# Altium schematic sheet sub-1Ghz_radio.SchDoc: Sub-1GHz Radio Module
size A3; Hw_rev: 0; License: GPLv3; Address3: Firenze; Address4: ITALY; DocumentNumber: 5; Revision: 0; SheetNumber: 5; SheetTotal: 8
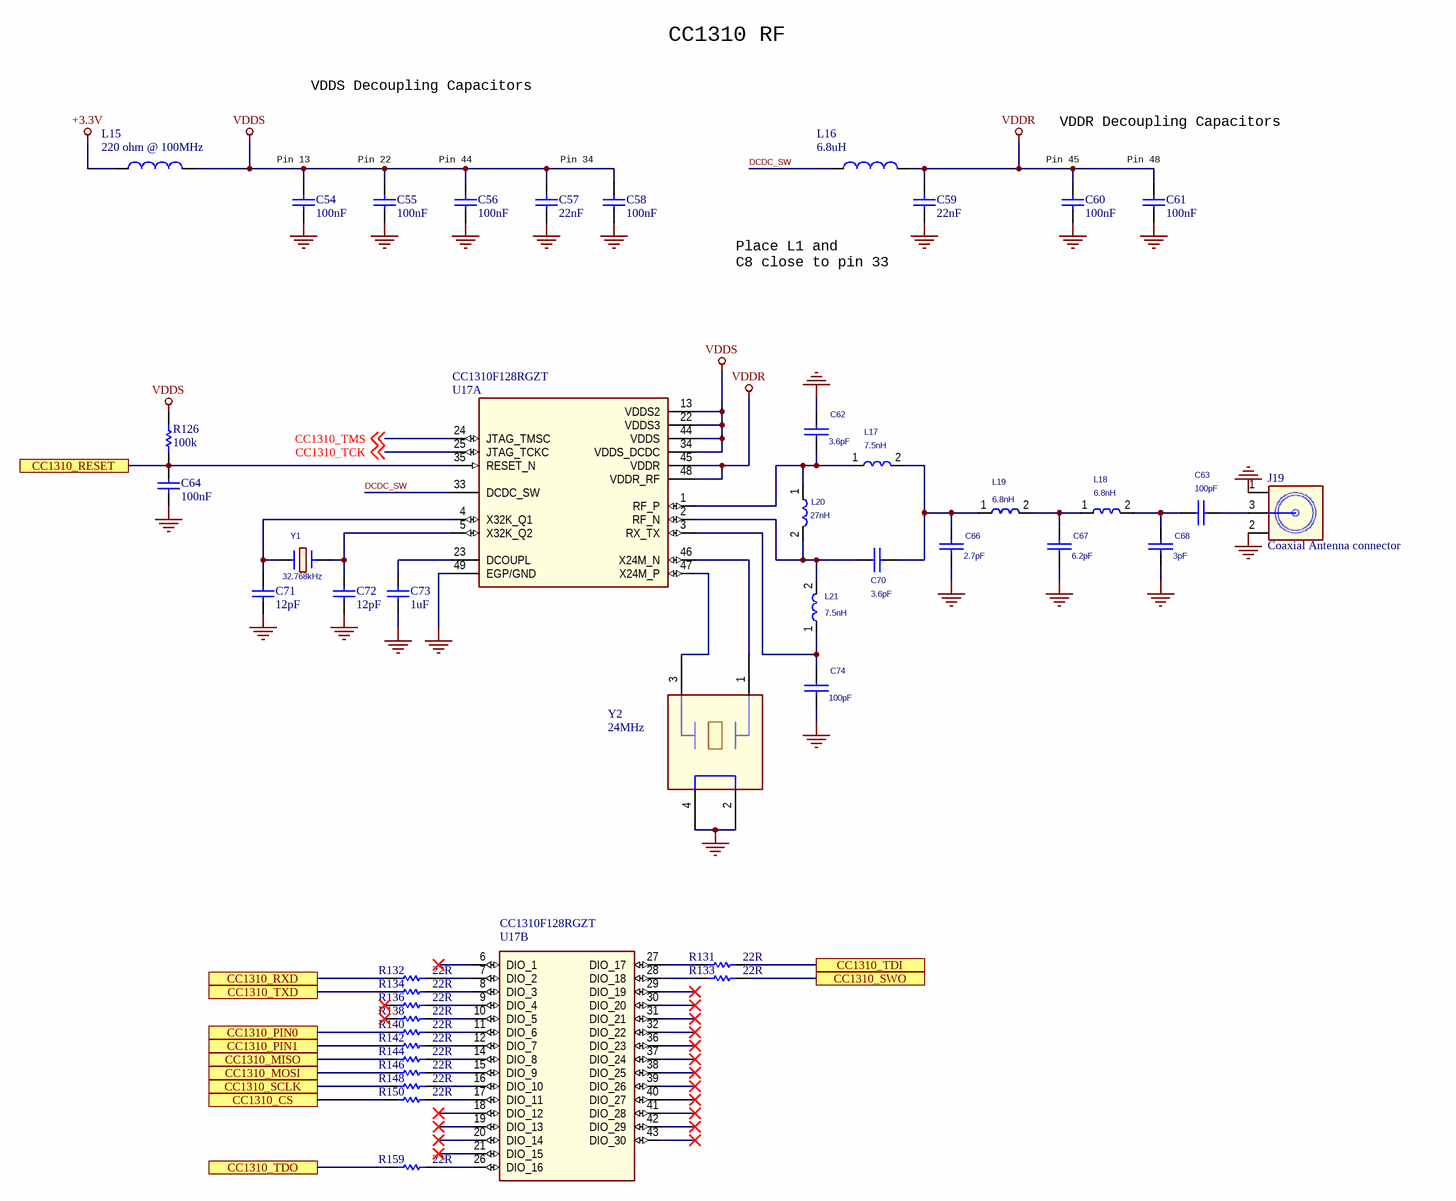
[diagram p0: sub-1Ghz_radio.SchDoc]

## Parts
C54  100nF  [0603_[1608]]
C55  100nF  [0603_[1608]]
C56  100nF  [0603_[1608]]
C57  22nF  [0603_[1608]]
C58  100nF  [0603_[1608]]
C59  22nF  [0603_[1608]]
C60  100nF  [0603_[1608]]
C61  100nF  [0603_[1608]]
C62  3.6pF  [0402_[1005]]
C63  100pF  [0402_[1005]]
C64  100nF  [0603_[1608]]
C66  2.7pF  [0402_[1005]]
C67  6.2pF  [0402_[1005]]
C68  3pF  [0402_[1005]]
C70  3.6pF  [0402_[1005]]
C71  12pF  [0603_[1608]]
C72  12pF  [0603_[1608]]
C73  1uF  [0805_[2012]]
C74  100pF  [0402_[1005]]
J19  Coaxial Antenna connector  [U.FL_COAXIAL_2.6x2.6MM_STRAIGHT_SMD]
L15  220 ohm @ 100MHz  [0805_[2012]]
L16  6.8uH  [0805_[2012]]
L17  7.5nH  [0402_[1005]]
L18  6.8nH  [0402_[1005]]
L19  6.8nH  [0402_[1005]]
L20  27nH  [0402_[1005]]
L21  7.5nH  [0402_[1005]]
R126  100k  [0603_[1608]]
R131  22R  [0603_[1608]]
R132  22R  [0603_[1608]]
R133  22R  [0603_[1608]]
R134  22R  [0603_[1608]]
R136  22R  [0603_[1608]]
R138  22R  [0603_[1608]]
R140  22R  [0603_[1608]]
R142  22R  [0603_[1608]]
R144  22R  [0603_[1608]]
R146  22R  [0603_[1608]]
R148  22R  [0603_[1608]]
R150  22R  [0603_[1608]]
R159  22R  [0603_[1608]]
U17  CC1310F128RGZT  [PQFN50P700X700X100-48N]  (parts A,B of 2)
Y1  32.768kHz  [CRYSTAL_3.2X1.5MM_2P_SMD]
Y2  24MHz  [CRYSTAL_3.2X2.5MM_4P_SMD]

## Ports
CC1310_CS, CC1310_MISO, CC1310_MOSI, CC1310_PIN0, CC1310_PIN1, CC1310_RESET, CC1310_RXD, CC1310_SCLK, CC1310_SWO, CC1310_TDI, CC1310_TDO, CC1310_TXD

## Nets
+3.3V: L15.2
GND: C54.1 C55.1 C56.1 C57.1 C58.1 C59.1 C60.1 C61.1 C62.1 C64.1 C66.2 C67.2 C68.2 C71.1 C72.1 C73.1 C74.2 J19.1(GND) J19.2(GND) U17.49(EGP/GND) Y2.2 Y2.4
VDDR: C59.2 C60.2 C61.2 L16.1 U17.45(VDDR) U17.48(VDDR_RF)
VDDS: C54.2 C55.2 C56.2 C57.2 C58.2 L15.1 R126.1 U17.13(VDDS2) U17.22(VDDS3) U17.34(VDDS_DCDC) U17.44(VDDS)
CC1310_CS: R150.2 ; port CC1310_CS
CC1310_MISO: R144.2 ; port CC1310_MISO
CC1310_MOSI: R146.2 ; port CC1310_MOSI
CC1310_PIN0: R140.2 ; port CC1310_PIN0
CC1310_PIN1: R142.2 ; port CC1310_PIN1
CC1310_RESET: C64.2 R126.2 U17.35(RESET_N) ; port CC1310_RESET
CC1310_RXD: R132.2 ; port CC1310_RXD
CC1310_SCLK: R148.2 ; port CC1310_SCLK
CC1310_SWO: R133.1 ; port CC1310_SWO
CC1310_TCK: U17.25(JTAG_TCKC) ; off-sheet CC1310_TCK
CC1310_TDI: R131.1 ; port CC1310_TDI
CC1310_TDO: R159.2 ; port CC1310_TDO
CC1310_TMS: U17.24(JTAG_TMSC) ; off-sheet CC1310_TMS
CC1310_TXD: R134.2 ; port CC1310_TXD
DCDC_SW: L16.2 U17.33(DCDC_SW)
NetC62_2: C62.2 L17.1 L20.1 U17.1(RF_P)
NetC63_1: C63.1 C68.1 L18.2
NetC63_2: C63.2 J19.3(SIG)
NetC66_1: C66.1 C70.2 L17.2 L19.1
NetC67_1: C67.1 L18.1 L19.2
NetC70_1: C70.1 L20.2 L21.2 U17.2(RF_N)
NetC71_2: C71.2 U17.4(X32K_Q1) Y1.1
NetC72_2: C72.2 U17.5(X32K_Q2) Y1.2
NetC73_2: C73.2 U17.23(DCOUPL)
NetC74_1: C74.1 L21.1 U17.3(RX_TX)
NetR131_2: R131.2 U17.27(DIO_17)
NetR132_1: R132.1 U17.7(DIO_2)
NetR133_2: R133.2 U17.28(DIO_18)
NetR134_1: R134.1 U17.8(DIO_3)
NetR136_1: R136.1 U17.9(DIO_4)
NetR138_1: R138.1 U17.10(DIO_5)
NetR140_1: R140.1 U17.11(DIO_6)
NetR142_1: R142.1 U17.12(DIO_7)
NetR144_1: R144.1 U17.14(DIO_8)
NetR146_1: R146.1 U17.15(DIO_9)
NetR148_1: R148.1 U17.16(DIO_10)
NetR150_1: R150.1 U17.17(DIO_11)
NetR159_1: R159.1 U17.26(DIO_16)
NetU17_46: U17.46(X24M_N) Y2.1
NetU17_47: U17.47(X24M_P) Y2.3

Not connected (* = marked no-connect by the designer): R136 2*; R138 2*; U17 6(DIO_1)* 18(DIO_12)* 19(DIO_13)* 20(DIO_14)* 21(DIO_15)* 29(DIO_19)* 30(DIO_20)* 31(DIO_21)* 32(DIO_22)* 36(DIO_23)* 37(DIO_24)* 38(DIO_25)* 39(DIO_26)* 40(DIO_27)* 41(DIO_28)* 42(DIO_29)* 43(DIO_30)*

## Notes on the sheet
- VDDS Decoupling Capacitors
- CC1310 RF
- VDDR Decoupling Capacitors
- (near C54) Pin 13
- (near C55) Pin 22
- (near C56) Pin 44
- Pin 34
- (near C60) Pin 45
- (near C61) Pin 48
- (near C59) Place L1 and
  C8 close to pin 33

## Library data of the parts
C54-C61 C64 C71-C73 = Cap: Ceramic X7R 50V; Value: 100pF; Published: 8-Jun-2000; LatestRevisionDate: 17-Jul-2002; LatestRevisionNote: Re-released for DXP Platform.; PackageReference: RAD-0.3; Publisher: Altium Limited; PackageDescription: Radial Cap, Thru-Hole; 2 Leads; 0.3 in Pin Spacing
C62 = CAPACITOR: CAPACITOR, CERAMIC C0G/NP0, 3.6pF, 50V, -0.25pF/+0.25pF, -55DEGC/+125DEGC, 0402, SMD; Vendor Part Status: ACTIVE; Vendor Part Number: GRM1555C1H3R6CA01D; Part Number: 02-07631; VOLTAGE: CMAX; CURRENT: CIMAX; KNEE: CBMAX; PSpiceTemplate: C^@REFDES %1 %2 ?TOLERANCE|C^@REFDES| @VALUE ?IC/IC=@IC/ TC=@TC1,@TC2 ?TOLERANCE|\n.model C^@REFDES CAP C=1 DEV=@TOLERANCE%|; DIST: FLAT; SLOPE: CSMAX; MAX_TEMP: CTMAX; TC1: 0; Vendor: MURATA; BU Name: TEXAS INSTRUMENTS NORWAY; Packing Type: TAPE_&_REEL; Packing Size: 10000; Definied Quality: INDUSTRIAL; Budget Currency: EUR; Budget Price: 0.006; Lead Time: 12; NOTE Status: PREFERRED; PCB Package: 0402; Old Footprint: CAPC1005X60N; TC2: 0; Value: 3.6pF; Country of Origin: MISSING INFO; AutoDoc File: https://notefied-dynamic-precision.com/DB/Apps/Desktop/Item/Object.aspx?id=113359; Datasheet URL 2: N/A; Datasheet URL 1: http://psearch.murata.com/capacitor/product/GRM1555C1H3R6CA01%23.pdf; MSL: N/A; MTBF Standard: N/A; MTBF: N/A; Esd Level: N/A; WEIGHT: 0.0016g; Last Time Buy: N/A; LifeCycle Status: ACTIVE; RoHS Status: ROHS_COMPLIANT; MPN Status: ACTIVE; MPN: GRM1555C1H3R6CA01D; Manufacturer: MURATA; Dielectric Type: C0G/NP0; Capacitance: 3.6pF; Rtd Voltage: 50V; Min Tol: -0.25pF; Max Tol: +0.25pF; Min Oper Temp: -55DEGC; Max Oper Temp: +125DEGC; Part Type: CAPACITOR\CERAMIC\0402\STANDARD; Mounting Type: SMD; Revision: R000
C63 C74 = CAPACITOR: Ceramic COG 50V; Vendor Part Status: ACTIVE; Vendor Part Number: GRM1555C1H101JA01D; Part Number: 02-07619; VOLTAGE: CMAX; CURRENT: CIMAX; KNEE: CBMAX; PSpiceTemplate: C^@REFDES %1 %2 ?TOLERANCE|C^@REFDES| @VALUE ?IC/IC=@IC/ TC=@TC1,@TC2 ?TOLERANCE|\n.model C^@REFDES CAP C=1 DEV=@TOLERANCE%|; DIST: FLAT; SLOPE: CSMAX; MAX_TEMP: CTMAX; TC1: 0; Vendor: MURATA; BU Name: TEXAS INSTRUMENTS NORWAY; Packing Type: TAPE_&_REEL; Packing Size: 10000; Definied Quality: INDUSTRIAL; Budget Currency: EUR; Budget Price: 0.004; Lead Time: 12; NOTE Status: PREFERRED; Dielectric Type: C0G/NP0; Min Tol: -5%; Max Tol: +5%; Min Oper Temp: -55DEGC; Max Oper Temp: +125DEGC; PCB Package: 0402; Old Footprint: CAPC1005X60N; TC2: 0; Value: 100pF; Country of Origin: CHINA,PHILIPPINES; AutoDoc File: https://notefied-dynamic-precision.com/DB/Apps/Desktop/Item/Object.aspx?id=113347; Datasheet URL 2: http://search.murata.co.jp/Ceramy/image/img/w_hinm/L0005E.pdf; Datasheet URL 1: http://psearch.murata.com/capacitor/product/GRM1555C1H101JA01%23.pdf; MSL: 1; MTBF Standard: N/A; MTBF: N/A; Esd Level: N/A; WEIGHT: 0.0016g; Last Time Buy: N/A; LifeCycle Status: ACTIVE; RoHS Status: ROHS_COMPLIANT; MPN Status: ACTIVE; MPN: GRM1555C1H101JA01D; Manufacturer: MURATA; Capacitance: 100pF; Rtd Voltage: 50V; Part Type: CAPACITOR\CERAMIC\0402\STANDARD; Mounting Type: SMD; Revision: R000
C66 = CAPACITOR: CAPACITOR, CERAMIC C0G/NP0, 2.7pF, 50V, -0.25pF/+0.25pF, -55DEGC/+125DEGC, 0402, SMD; MPN Status: ACTIVE; MPN: GRM1555C1H2R7CA01D; Manufacturer: MURATA; Part Number: 02-07628; VOLTAGE: CMAX; CURRENT: CIMAX; KNEE: CBMAX; PSpiceTemplate: C^@REFDES %1 %2 ?TOLERANCE|C^@REFDES| @VALUE ?IC/IC=@IC/ TC=@TC1,@TC2 ?TOLERANCE|\n.model C^@REFDES CAP C=1 DEV=@TOLERANCE%|; DIST: FLAT; SLOPE: CSMAX; MAX_TEMP: CTMAX; TC1: 0; Packing Type: TAPE_&_REEL; Packing Size: 10000; Definied Quality: INDUSTRIAL; Budget Currency: EUR; Budget Price: 0.007; Lead Time: 12; NOTE Status: PREFERRED; PCB Package: 0402; Old Footprint: CAPC1005X60N; BU Name: TEXAS INSTRUMENTS NORWAY; TC2: 0; Value: 2.7pF; AutoDoc File: https://notefied-dynamic-precision.com/DB/Apps/Desktop/Item/Object.aspx?id=113356; Datasheet URL 2: http://search.murata.co.jp/Ceramy/image/img/w_hinm/L0005E.pdf; Datasheet URL 1: http://psearch.murata.com/capacitor/product/GRM1555C1H2R7CA01%23.pdf; MSL: 1; MTBF Standard: N/A; MTBF: N/A; Esd Level: N/A; WEIGHT: 0.0016g; Last Time Buy: N/A; LifeCycle Status: ACTIVE; RoHS Status: ROHS_COMPLIANT; Dielectric Type: C0G/NP0; Capacitance: 2.7pF; Rtd Voltage: 50V; Min Tol: -0.25pF; Max Tol: +0.25pF; Min Oper Temp: -55DEGC; Max Oper Temp: +125DEGC; Part Type: CAPACITOR\CERAMIC\0402\STANDARD; Mounting Type: SMD; Revision: R000; Vendor: MURATA; Vendor Part Number: GRM1555C1H2R7CA01D; Vendor Part Status: ACTIVE; Country of Origin: PHILIPPINES
C67 = CAPACITOR: CAPACITOR, CERAMIC C0G/NP0, 6.2pF, 50V, -0.25pF/+0.25pF, -55DEGC/+125DEGC, 0402, SMD; MPN Status: ACTIVE; MPN: GRM1555C1H6R2CA01D; Manufacturer: MURATA; Part Number: 02-07626; VOLTAGE: CMAX; CURRENT: CIMAX; KNEE: CBMAX; PSpiceTemplate: C^@REFDES %1 %2 ?TOLERANCE|C^@REFDES| @VALUE ?IC/IC=@IC/ TC=@TC1,@TC2 ?TOLERANCE|\n.model C^@REFDES CAP C=1 DEV=@TOLERANCE%|; DIST: FLAT; SLOPE: CSMAX; MAX_TEMP: CTMAX; TC1: 0; Packing Type: TAPE_&_REEL; Packing Size: 10000; Definied Quality: INDUSTRIAL; Budget Currency: EUR; Budget Price: 0.007; Lead Time: 14; NOTE Status: PREFERRED; PCB Package: 0402; Old Footprint: CAPC1005X60N; BU Name: TEXAS INSTRUMENTS NORWAY; TC2: 0; Value: 6.2pF; AutoDoc File: https://notefied-dynamic-precision.com/DB/Apps/Desktop/Item/Object.aspx?id=113354; Datasheet URL 2: http://search.murata.co.jp/Ceramy/image/img/w_hinm/L0005E.pdf; Datasheet URL 1: http://psearch.murata.com/capacitor/product/GRM1555C1H6R2CA01%23.pdf; MSL: 1; MTBF Standard: N/A; MTBF: N/A; Esd Level: N/A; WEIGHT: 0.0016g; Last Time Buy: N/A; LifeCycle Status: ACTIVE; RoHS Status: ROHS_COMPLIANT; Dielectric Type: C0G/NP0; Capacitance: 6.2pF; Rtd Voltage: 50V; Min Tol: -0.25pF; Max Tol: +0.25pF; Min Oper Temp: -55DEGC; Max Oper Temp: +125DEGC; Part Type: CAPACITOR\CERAMIC\0402\STANDARD; Mounting Type: SMD; Revision: R000; Vendor: MURATA; Vendor Part Number: GRM1555C1H6R2CA01D; Vendor Part Status: ACTIVE; Country of Origin: PHILIPPINES
C68 = CAPACITOR: CAPACITOR, CERAMIC C0G/NP0, 3pF, 50V, -0.25pF/+0.25pF, -55DEGC/+125DEGC, 0402, SMD; MPN Status: ACTIVE; MPN: GRM1555C1H3R0CA01D; Manufacturer: MURATA; Part Number: 02-07625; VOLTAGE: CMAX; CURRENT: CIMAX; KNEE: CBMAX; PSpiceTemplate: C^@REFDES %1 %2 ?TOLERANCE|C^@REFDES| @VALUE ?IC/IC=@IC/ TC=@TC1,@TC2 ?TOLERANCE|\n.model C^@REFDES CAP C=1 DEV=@TOLERANCE%|; DIST: FLAT; SLOPE: CSMAX; MAX_TEMP: CTMAX; TC1: 0; Packing Type: TAPE_&_REEL; Packing Size: 10000; Definied Quality: INDUSTRIAL; Budget Currency: EUR; Budget Price: 0.006; Lead Time: 16; NOTE Status: PREFERRED; PCB Package: 0402; Old Footprint: CAPC1005X60N; BU Name: TEXAS INSTRUMENTS NORWAY; TC2: 0; Value: 3pF; AutoDoc File: https://notefied-dynamic-precision.com/DB/Apps/Desktop/Item/Object.aspx?id=113353; Datasheet URL 2: http://search.murata.co.jp/Ceramy/image/img/w_hinm/L0005E.pdf; Datasheet URL 1: http://psearch.murata.com/capacitor/product/GRM1555C1H3R0CA01%23.pdf; MSL: 1; MTBF Standard: N/A; MTBF: N/A; Esd Level: N/A; WEIGHT: 0.0016g; Last Time Buy: N/A; LifeCycle Status: ACTIVE; RoHS Status: ROHS_COMPLIANT; Dielectric Type: C0G/NP0; Capacitance: 3pF; Rtd Voltage: 50V; Min Tol: -0.25pF; Max Tol: +0.25pF; Min Oper Temp: -55DEGC; Max Oper Temp: +125DEGC; Part Type: CAPACITOR\CERAMIC\0402\STANDARD; Mounting Type: SMD; Revision: R000; Vendor: MURATA; Vendor Part Number: GRM1555C1H3R0CA01D; Vendor Part Status: ACTIVE; Country of Origin: PHILIPPINES
C70 = CAPACITOR: CAPACITOR, CERAMIC C0G/NP0, 3.6pF, 50V, -0.25pF/+0.25pF, -55DEGC/+125DEGC, 0402, SMD; Vendor Part Status: ACTIVE; Vendor Part Number: GRM1555C1H3R6CA01D; Part Number: 02-07631; VOLTAGE: CMAX; CURRENT: CIMAX; KNEE: CBMAX; PSpiceTemplate: C^@REFDES %1 %2 ?TOLERANCE|C^@REFDES| @VALUE ?IC/IC=@IC/ TC=@TC1,@TC2 ?TOLERANCE|\n.model C^@REFDES CAP C=1 DEV=@TOLERANCE%|; DIST: FLAT; SLOPE: CSMAX; MAX_TEMP: CTMAX; TC1: 0; Vendor: MURATA; BU Name: TEXAS INSTRUMENTS NORWAY; Old Footprint: CAPC1005X60N; PCB Package: 0402; NOTE Status: PREFERRED; Lead Time: 12; Budget Price: 0.006; Budget Currency: EUR; Definied Quality: INDUSTRIAL; Packing Size: 10000; Packing Type: TAPE_&_REEL; TC2: 0; Value: 3.6pF; Country of Origin: MISSING INFO; Revision: R000; Mounting Type: SMD; Part Type: CAPACITOR\CERAMIC\0402\STANDARD; Max Oper Temp: +125DEGC; Min Oper Temp: -55DEGC; Max Tol: +0.25pF; Min Tol: -0.25pF; Rtd Voltage: 50V; Capacitance: 3.6pF; Dielectric Type: C0G/NP0; Manufacturer: MURATA; MPN: GRM1555C1H3R6CA01D; MPN Status: ACTIVE; RoHS Status: ROHS_COMPLIANT; LifeCycle Status: ACTIVE; Last Time Buy: N/A; WEIGHT: 0.0016g; Esd Level: N/A; MTBF: N/A; MTBF Standard: N/A; MSL: N/A; Datasheet URL 1: http://psearch.murata.com/capacitor/product/GRM1555C1H3R6CA01%23.pdf; Datasheet URL 2: N/A; AutoDoc File: https://notefied-dynamic-precision.com/DB/Apps/Desktop/Item/Object.aspx?id=113359
J19 = ANTENNA_3P_COAXIAL_CONNECTOR: U.FL serias
L15 = Inductor: WE 742792022
L16 = Inductor: Inductor WE 742792022
L17 L21 = INDUCTOR: INDUCTOR, RF, CHIP, NON-MAGNETIC CORE, 7.5nH, -5%/+5%, 0.3A, -55DEGC/+125DEGC, 0402, SMD; Part Number: 03-07533; Vendor Part Number: LQG15HS7N5J02D; Vendor Part Status: ACTIVE; DIST: FLAT; DIELECTRIC: DSMAX; PSpiceTemplate: L^@REFDES %1 %2 ?TOLERANCE|L^@REFDES| @VALUE ?IC/IC=@IC/ ?TOLERANCE|\n.model l^@REFDES IND L=1 DEV=@TOLERANCE%|; Current: LMAX; BU Name: TEXAS INSTRUMENTS NORWAY; PCB Package: 0402; Max Tol: +5%; Min Tol: -5%; Resistance: 0.24; Frequency: 4.2GHz; Vendor: MURATA; Lead Time: 10; Budget Price: 0.03; Budget Currency: EUR; Packing Size: 10000; Packing Type: TAPE_&_REEL; Value: 7.5nH; Revision: R000; Mounting Type: SMD; Part Type: INDUCTOR\RF\CHIP\0402; Max Oper Temp: +125DEGC; Min Oper Temp: -55DEGC; Rtd Current: 0.3A; Inductance: 7.5nH; Core Material: NON-MAGNETIC; RoHS Status: ROHS_COMPLIANT; Last Time Buy: N/A; Weight: 0.001g; Country of Origin: MISSING INFO; Datasheet URL 1: http://psearch.murata.com/inductor/product/LQG15HS7N5J02%23.pdf; Datasheet URL 2: N/A; AutoDoc File: https://notefied-dynamic-precision.com/DB/Apps/Desktop/Item/Object.aspx?id=113370
L18 L19 = INDUCTOR: INDUCTOR, RF, CHIP, NON-MAGNETIC CORE, 6.8nH, -5%/+5%, 0.3A, -55DEGC/+125DEGC, 0402, SMD; Vendor Part Status: ACTIVE; Vendor Part Number: LQG15HS6N8J02D; Part Number: 03-07532; DIST: FLAT; DIELECTRIC: DSMAX; PSpiceTemplate: L^@REFDES %1 %2 ?TOLERANCE|L^@REFDES| @VALUE ?IC/IC=@IC/ ?TOLERANCE|\n.model l^@REFDES IND L=1 DEV=@TOLERANCE%|; Current: LMAX; Vendor: MURATA; BU Name: TEXAS INSTRUMENTS NORWAY; Old Footprint: INDC1005X60N; PCB Package: 0402; Max Tol: +5%; Min Tol: -5%; Resistance: 0.24; Frequency: 4.5GHz; NOTE Status: PREFERRED; Lead Time: 9; Budget Price: 0.03; Budget Currency: EUR; Definied Quality: INDUSTRIAL; Packing Size: 10000; Packing Type: TAPE_&_REEL; Value: 6.8nH; Country of Origin: JAPAN,SINGAPORE; Core Material: NON-MAGNETIC; Revision: R000; Mounting Type: SMD; Part Type: INDUCTOR\RF\CHIP\0402; Max Oper Temp: +125DEGC; Min Oper Temp: -55DEGC; Rtd Current: 0.3A; Inductance: 6.8nH; Manufacturer: MURATA; MPN: LQG15HS6N8J02D; MPN Status: ACTIVE; RoHS Status: ROHS_COMPLIANT; LifeCycle Status: ACTIVE; Last Time Buy: N/A; WEIGHT: 0.001g; Esd Level: N/A; MTBF: N/A; MTBF Standard: N/A; MSL: N/A; Datasheet URL 1: http://psearch.murata.com/inductor/product/LQG15HS6N8J02%23.pdf; Datasheet URL 2: N/A; AutoDoc File: https://notefied-dynamic-precision.com/DB/Apps/Desktop/Item/Object.aspx?id=113369
L20 = INDUCTOR: INDUCTOR, RF, CHIP, NON-MAGNETIC CORE, 27nH, -5%/+5%, 0.3A, -55DEGC/+125DEGC, 0402, SMD; Vendor Part Status: ACTIVE; Vendor Part Number: LQG15HS27NJ02D; Part Number: 03-07528; DIST: FLAT; DIELECTRIC: DSMAX; PSpiceTemplate: L^@REFDES %1 %2 ?TOLERANCE|L^@REFDES| @VALUE ?IC/IC=@IC/ ?TOLERANCE|\n.model l^@REFDES IND L=1 DEV=@TOLERANCE%|; Current: LMAX; Vendor: MURATA; BU Name: TEXAS INSTRUMENTS NORWAY; Old Footprint: INDC1005X60N; PCB Package: 0402; Max Tol: +5%; Min Tol: -5%; Resistance: 0.46; Frequency: 1700MHz; NOTE Status: PREFERRED; Lead Time: 9; Budget Price: 0.03; Budget Currency: EUR; Definied Quality: INDUSTRIAL; Packing Size: 10000; Packing Type: TAPE_&_REEL; Value: 27nH; Country of Origin: JAPAN,SINGAPORE; Core Material: NON-MAGNETIC; Revision: R000; Mounting Type: SMD; Part Type: INDUCTOR\RF\CHIP\0402; Max Oper Temp: +125DEGC; Min Oper Temp: -55DEGC; Rtd Current: 0.3A; Inductance: 27nH; Manufacturer: MURATA; MPN: LQG15HS27NJ02D; MPN Status: ACTIVE; RoHS Status: ROHS_COMPLIANT; LifeCycle Status: ACTIVE; Last Time Buy: N/A; WEIGHT: 0.001g; Esd Level: N/A; MTBF: N/A; MTBF Standard: N/A; MSL: N/A; Datasheet URL 1: http://psearch.murata.com/inductor/product/LQG15HS27NJ02%23.pdf; Datasheet URL 2: N/A; AutoDoc File: https://notefied-dynamic-precision.com/DB/Apps/Desktop/Item/Object.aspx?id=113365
R126 R131-R134 R136 R138 R140 R142 R144 R146 R148 R150 R159 = Res1: Resistor; Value: 1K; Published: 8-Jun-2000; Revision: July-2002: Re-released for DXP Platform.; Publisher: Altium Limited
U17 = CC1310F128RGZT_VQFN48: Texas CC1310 RF Cpu; CLASS: IC; SWAP_INFO: (S1+S2); SPLIT_INST: TRUE; Designed_By: Artur Bielinski; Design_Date: 2015-11-27
Y1 = CRYSTAL: CRYSTAL, RESONATOR, 32.768kHz, -20PPM/+20PPM, -40DEGC/+85DEGC, SMD; MPN Status: ACTIVE; MPN: FC-135 32.7680KA-AG0; Manufacturer: EPSON; Part Number: 12-00546; Packing Type: TAPE_&_REEL; Packing Size: 1000; Definied Quality: INDUSTRIAL; Budget Currency: USD; Budget Price: 1.25375; Lead Time: 10; NOTE Status: PREFERRED; Capacitance: 7pF; Min Tol: -20PPM; Max Tol: +20PPM; Old Footprint: XTAL_FC-135N; ALT_SYMBOLS: XTAL_FC-135L,XTAL_FC-135M; FPLIST: XTAL_FC-135N,XTAL_FC-135L,XTAL_FC-135M; AutoDoc File: http://notefied-dynamic-precision.com/DB/Apps/Desktop/Item/Object.aspx?id=91966; Datasheet URL 2: http://www.eea.epson.com/portal/pls/portal/docs/1/1525451.PDF; Datasheet URL 1: http://www.eea.epson.com/portal/pls/portal/docs/1/1525528.PDF; MSL: N/A; MTBF Standard: N/A; MTBF: N/A; Esd Level: N/A; WEIGHT: N/A; Last Time Buy: N/A; RoHS Status: ROHS_COMPLIANT; Frequency: 32.768kHz; Min Oper Temp: -40DEGC; Max Oper Temp: +85DEGC; Part Type: CRYSTAL\OSCILLATOR\MEMS; Mounting Type: SMD; Revision: R001
Y2 = CRYSTAL-4p: Crystal